# EAGLE design untitled (EAGLE 9.6.2)
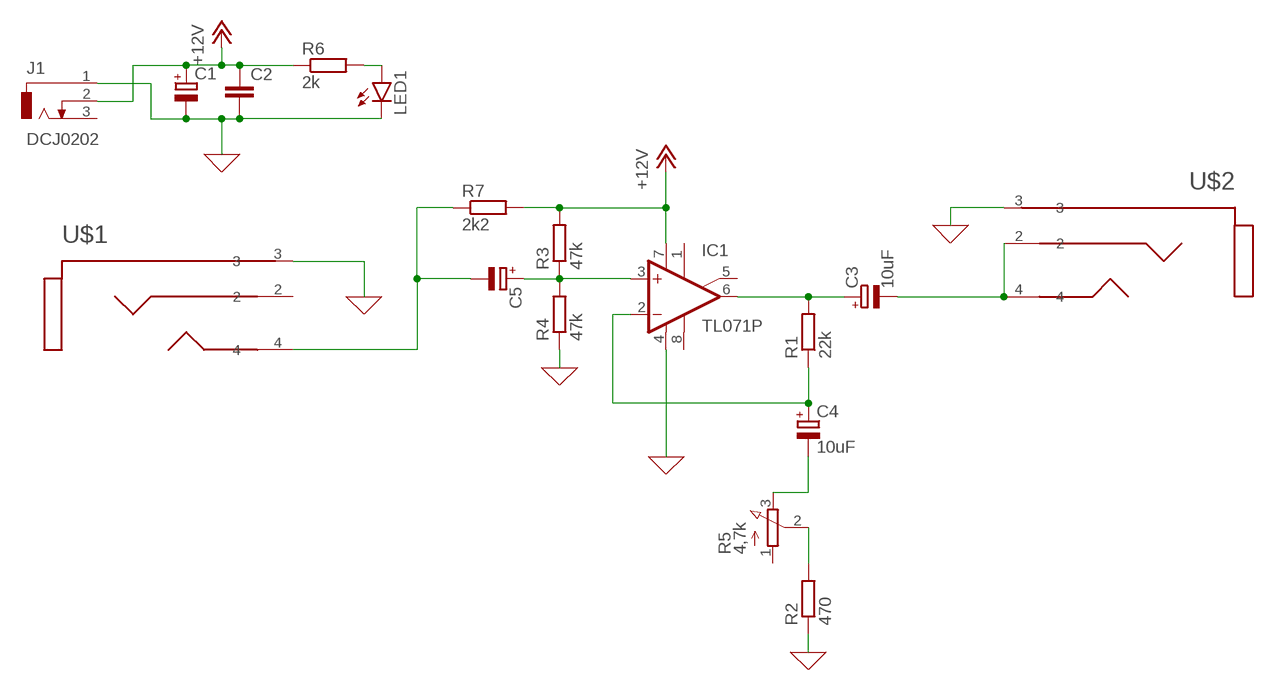
[diagram p0: schematic, sheet 1]

## Parts
C1  CPOL-EUE2,5-6E  [E2,5-6E]
C2  C-EU025-025X050  [C025-025X050]
C3  10uF  CPOL-EUE2,5-6E  [E2,5-6E]
C4  10uF  CPOL-EUE2,5-6E  [E2,5-6E]
C5  CPOL-EUE2,5-6E  [E2,5-6E]
IC1  TL071P  [DIL08]
J1  DCJ0202  [DCJ0202]
LED1  LED5MM  [LED5MM]
R1  22k  R-EU_0207/10  [0207/10]
R2  470  R-EU_0207/10  [0207/10]
R3  47k  R-EU_0207/10  [0207/10]
R4  47k  R-EU_0207/10  [0207/10]
R5  4,7k  3RP/1610N  [3RP/1610N]
R6  2k  R-EU_0207/10  [0207/10]
R7  2k2  R-EU_0207/10  [0207/10]
U$1  PJ321  [PJ321]
U$2  PJ321  [PJ321]

## Nets
0: C1.- C2.2 IC1.4(V-) J1.1 LED1.K(C) R2.1 R4.1 U$1.3 U$2.3 ; supply symbol labelled GND
+12V: C1.+ C2.1 IC1.7(V+) J1.2 R3.2 R6.1 R7.2
N$1: C3.+ IC1.6(OUT) R1.2
N$2: C4.+ IC1.2(-IN) R1.1
N$3: C5.+ IC1.3(+IN) R3.1 R4.2
N$4: C4.- R5.3(E)
N$5: R2.2 R5.2(S)
N$6: LED1.A R6.2
N$7: C5.- R7.1 U$1.4
N$9: C3.- U$2.2 U$2.4
Unconnected: IC1.1(ON1) IC1.5(ON2) IC1.8(OPT) J1.3 R5.1(A) U$1.2

## Library data of the parts
C1 C3-C5 = rcl:CPOL-EU: POLARIZED CAPACITOR, European symbol; SPICEPREFIX: C
C2 = rcl:C-EU: CAPACITOR, European symbol; SPICEPREFIX: C
IC1 = linear:TL071: OP AMP
J1 = con-jack:DCJ0202: DC POWER JACK Source: DCJ0202.pdf; OC_FARNELL: unknown; OC_NEWARK: unknown
LED1 = led:LED: LED OSRAM: - CHIPLED LG R971, LG N971, LY N971, LG Q971, LY Q971, LO R971, LY R971 LH N974, LH R974 LS Q976, LO Q976, LY Q976 LO Q996 - Hyper CHIPLED LW Q18S LB Q993, LB Q99A, LB R99A - SideLED LS A670, LO A670, LY A670, LG A670, LP A670 LB A673, LV A673, LT A673, LW A673 LH A674 LY A675 LS A676, LA A676, LO A676, LY A676, LW A676 LS A679, LY A679, LG A679 - Hyper Micro SIDELED® LS Y876, LA Y876, LO Y876, LY Y876 LT Y87S - SmartLED LW L88C, LW L88S LB L89C, LB L89S, LG L890 LS L89K, LO L89K, LY L89K LS L896, LA L896, LO L896, LY L896 - TOPLED LS T670, LO T670, LY T670, LG T670, LP T670 LSG T670, LSP T670, LSY T670, LOP T670, LYG T670 LG T671, LOG T671, LSG T671 LB T673, LV T673, LT T673, LW T673 LH T674 LS T676, LA T676, LO T676, LY T676, LB T676, LH T676, LSB T676, LW T676 LB T67C, LV T67C, LT T67C, LS T67K, LO T67K, LY T67K, LW E67C LS E67B, LA E67B, LO E67B, LY E67B, LB E67C, LV E67C, LT E67C LW T67C LS T679, LY T679, LG T679 LS T770, LO T770, LY T770, LG T770, LP T770 LB T773, LV T773, LT T773, LW T773 LH T774 LS E675, LA E675, LY E675, LS T675 LS T776, LA T776, LO T776, LY T776, LB T776 LHGB T686 LT T68C, LB T68C - Hyper Mini TOPLED® LB M676 - Mini TOPLED Santana® LG M470 LS M47K, LO M47K, LY M47K Source: http://www.osram.convergy.de LUXEON: - LUMILED® LXK2-PW12-R00, LXK2-PW12-S00, LXK2-PW14-U00, LXK2-PW14-V00 LXK2-PM12-R00, LXK2-PM12-S00, LXK2-PM14-U00 LXK2-PE12-Q00, LXK2-PE12-R00, LXK2-PE12-S00, LXK2-PE14-T00, LXK2-PE14-U00 LXK2-PB12-K00, LXK2-PB12-L00, LXK2-PB12-M00, LXK2-PB14-N00, LXK2-PB14-P00, LXK2-PB14-Q00 LXK2-PR12-L00, LXK2-PR12-M00, LXK2-PR14-Q00, LXK2-PR14-R00 LXK2-PD12-Q00, LXK2-PD12-R00, LXK2-PD12-S00 LXK2-PH12-R00, LXK2-PH12-S00 LXK2-PL12-P00, LXK2-PL12-Q00, LXK2-PL12-R00 Source: www.luxeon.com KINGBRIGHT: KA-3528ASYC Source: www.kingbright.com
R1-R4 R6 R7 = rcl:R-EU_: RESISTOR, European symbol; SPICEPREFIX: R
R5 = pot:3RP/1610N: 16mm Potentiometer one level Source: http://www.alphapotentiometers.net/html/16mm_pot_2.html
U$1 U$2 = pj321:PJ321: PJ321 3.5mm TRS Phone Jack

## Board
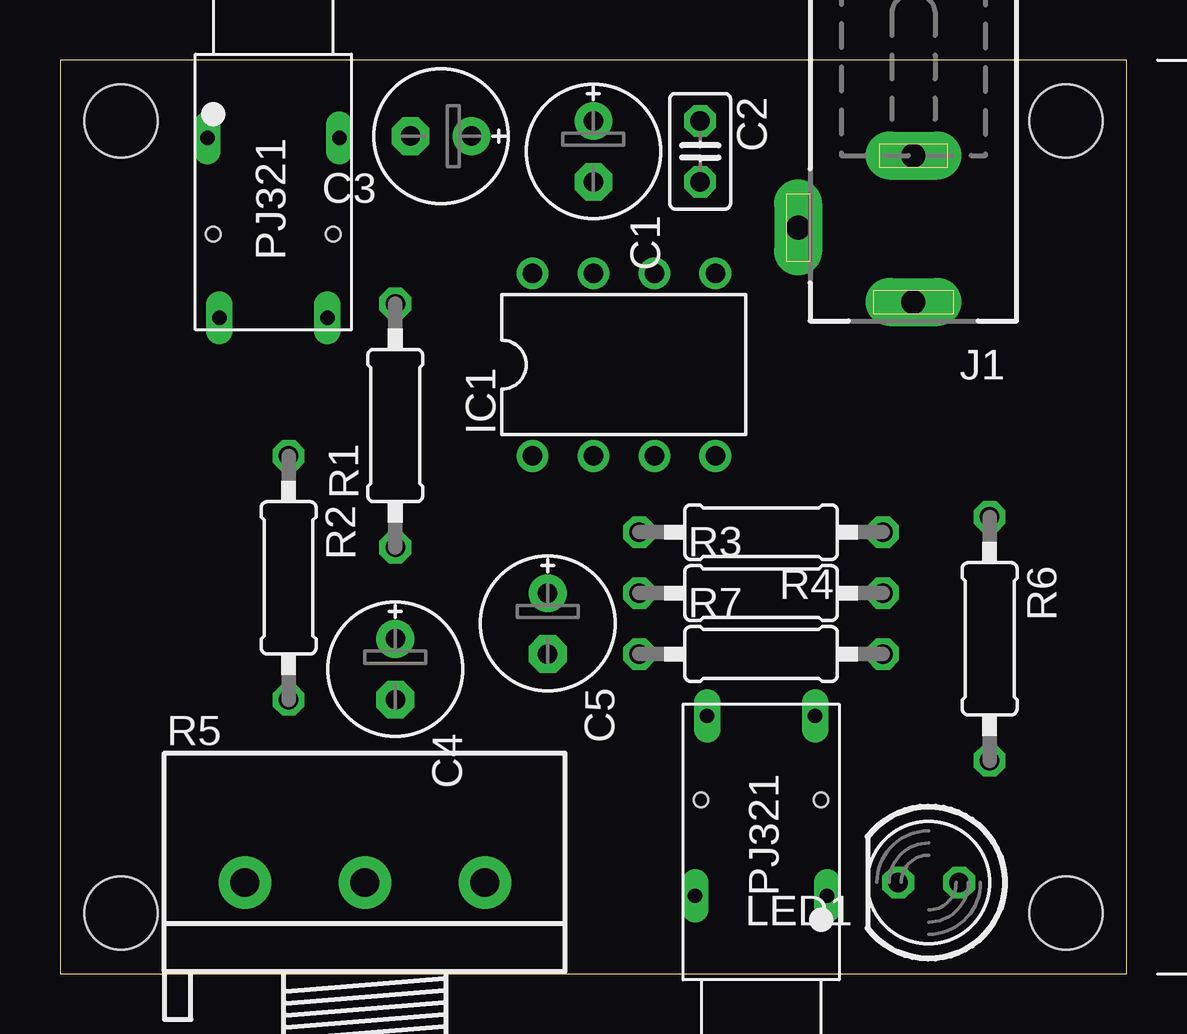
[diagram p1: board, top side]
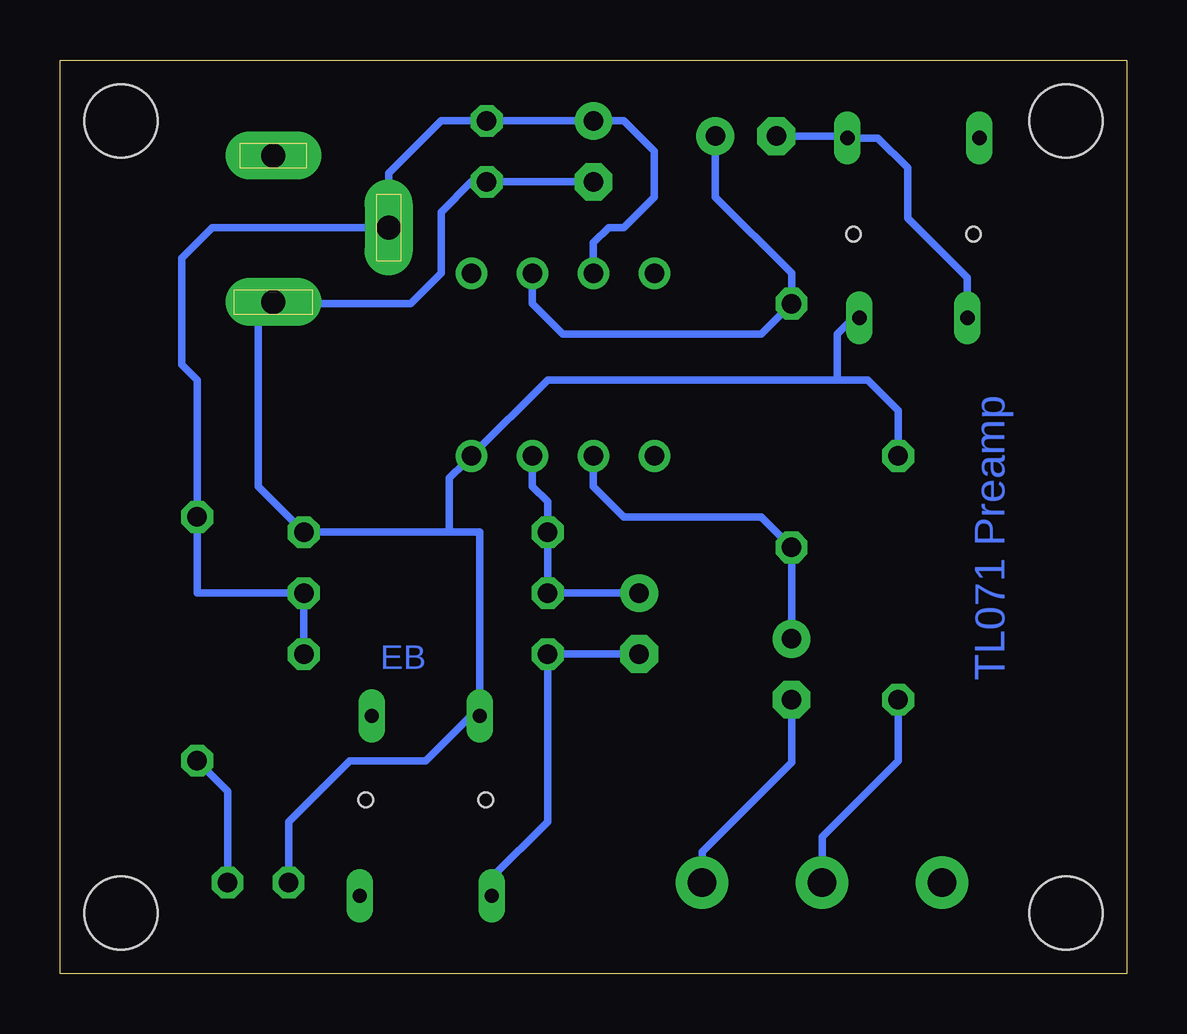
[diagram p2: board, bottom side, seen from below]

Size 44.45 x 38.1 mm. Coordinates in mm from the lower left corner, seen from the top.
Outline: 0,0 44.45,0 44.45,38.1 0,38.1 0,0
Copper layers (1*16): Top 0.035mm / dielectric 1.5mm / Bottom 0.035mm
Design rules "default": minimum track width 6mil, minimum drill 0.35mm, track to track 6mil, track to pad 6mil, pad to pad 6mil, via to via 6mil, smd to smd 6mil, copper to edge 40mil, drill to drill 6mil, minimum pad ring 10mil, minimum via ring 8mil, stop-mask expansion 4mil, vias tented up to drill 0mil, thermal gap 10mil
Holes 3.05 mm at 2.54,35.56 41.91,2.54 41.91,35.56 2.54,2.54

### Footprints (pad centres in the part's own frame; a part is rotated, then mirrored left to right if it is on the bottom)
E2,5-6E = drill 0.813 pad 1.575: + -1.27,0 | drill 0.813 pad 1.575 octagon: - 1.27,0
C025-025X050 = drill 0.813 octagon: 1 -1.27,0; 2 1.27,0
DIL08 = drill 0.813 pad 1.27: 1 -3.81,-3.81; 2 -1.27,-3.81; 3 1.27,-3.81; 4 3.81,-3.81; 5 3.81,3.81; 6 1.27,3.81; 7 -1.27,3.81; 8 -3.81,3.81
DCJ0202 = drill 1 pad 2 long: 1 0,3.1; 2 4.8,0; 3 0,-3
LED5MM = drill 0.813 octagon: A -1.27,0; K 1.27,0
0207/10 = drill 0.813 octagon: 1 -5.08,0; 2 5.08,0
3RP/1610N = drill 1.2 pad 2.184: 1 -5,0; 2 0,0; 3 5,0
PJ321 = drill 0.6 long: 1 -5,-2.75; 2 2.5,-2.25; 3 2.5,2.25; 4 -5,2.75 | hole 0.6: -1,-2.5; -1,2.5

### Placement (x,y rotation side)
C1  22.23,34.29 270 top
C2  26.67,34.29 270 top
C3  15.88,34.92 180 top
C4  13.97,12.7 270 top
C5  20.32,14.61 270 top
IC1  23.5,25.4 0 top
J1  35.56,31.11 180 top
LED1  36.2,3.81 180 top
R1  13.97,22.86 90 top
R2  9.52,16.51 270 top
R3  29.21,15.88 0 top
R4  29.21,18.41 180 top
R5  12.7,3.81 0 top
R6  38.73,13.97 270 top
R7  29.21,13.34 0 top
U$1  29.21,8.26 90 top
U$2  8.89,29.84 270 top

### Tracks (layer width: path | path; a pad name or v marks a point on that pad's centre or on a via)
0
  Bottom 0.305: 26.96,11.72 U$1.3 | U$1.3 27.35,10.76 29.21,8.89 32.38,8.89 34.92,6.35 LED1.K | J1.1 35.48,27.94 | 35.48,27.94 36.12,27.94 36.2,27.86 36.2,20.32 R4.1 28.23,18.41 | 35.48,27.94 29.85,27.94 28.57,29.21 28.57,31.75 27.3,33.02 C2.2 C1.- | 12.07,24.77 24.13,24.77 IC1.4 27.6,21.3 | 11.1,27.3 U$2.3 11.39,27.34 12.07,26.67 12.07,24.77 | R2.1 9.52,23.5 10.79,24.77 12.07,24.77 | 28.23,18.41 28.23,20.66 27.6,21.3 | U$1.3 26.96,18.41 28.23,18.41 | 27.6,21.3 27.6,21.59
+12V
  Bottom 0.305: 21.59,35.56 C1.+ | C1.+ C2.1 28.57,35.56 30.76,33.38 J1.2 38.1,31.11 39.37,29.84 39.37,25.4 38.73,24.77 R6.1 38.73,15.88 R3.2 R7.2 | C1.+ 20.96,35.56 19.69,34.29 19.69,32.38 20.96,31.11 21.59,31.11 22.23,30.48 IC1.7
N$1
  Bottom 0.305: IC1.6 24.77,27.94 23.5,26.67 15.24,26.67 R1.2 13.97,29.21 17.14,32.38 C3.+
N$2
  Bottom 0.305: IC1.2 22.23,20.32 20.96,19.05 15.24,19.05 R1.1 C4.+
N$3
  Bottom 0.305: IC1.3 24.77,20.32 24.13,19.68 R4.2 R3.1 C5.+
N$4
  Bottom 0.305: R5.3 17.7,5.08 13.97,8.81 C4.-
N$5
  Bottom 0.305: R5.2 12.7,5.71 9.52,8.89 R2.2
N$6
  Bottom 0.305: R6.2 37.46,7.62 LED1.A
N$7
  Bottom 0.305: U$1.4 26.46,4.02 24.13,6.35 R7.1 C5.-
N$9
  Bottom 0.305: C3.- 11.72,34.92 U$2.4 10.37,34.84 9.13,33.6 9.13,31.51 6.64,29.02 U$2.2

### Text on the board
Bottom: TL071 Preamp | EB